# EAGLE board KMO_IO_MV2_8 (EAGLE 9.5.1)
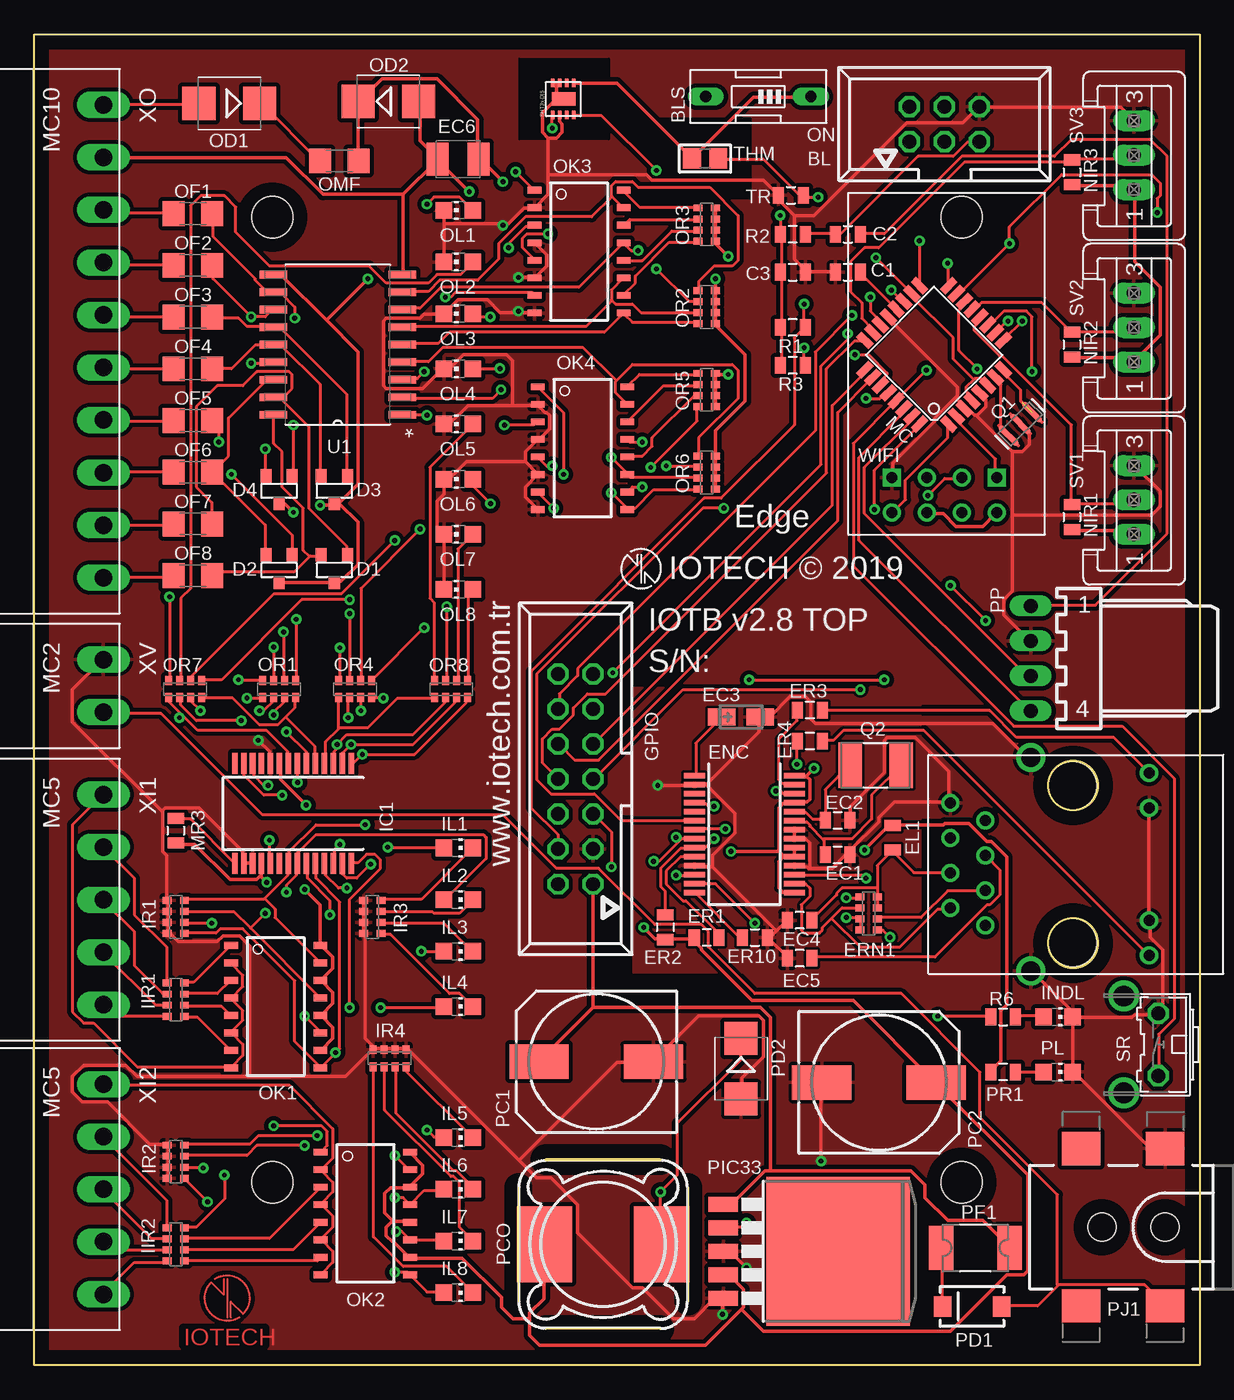
[diagram p2: board, top side]
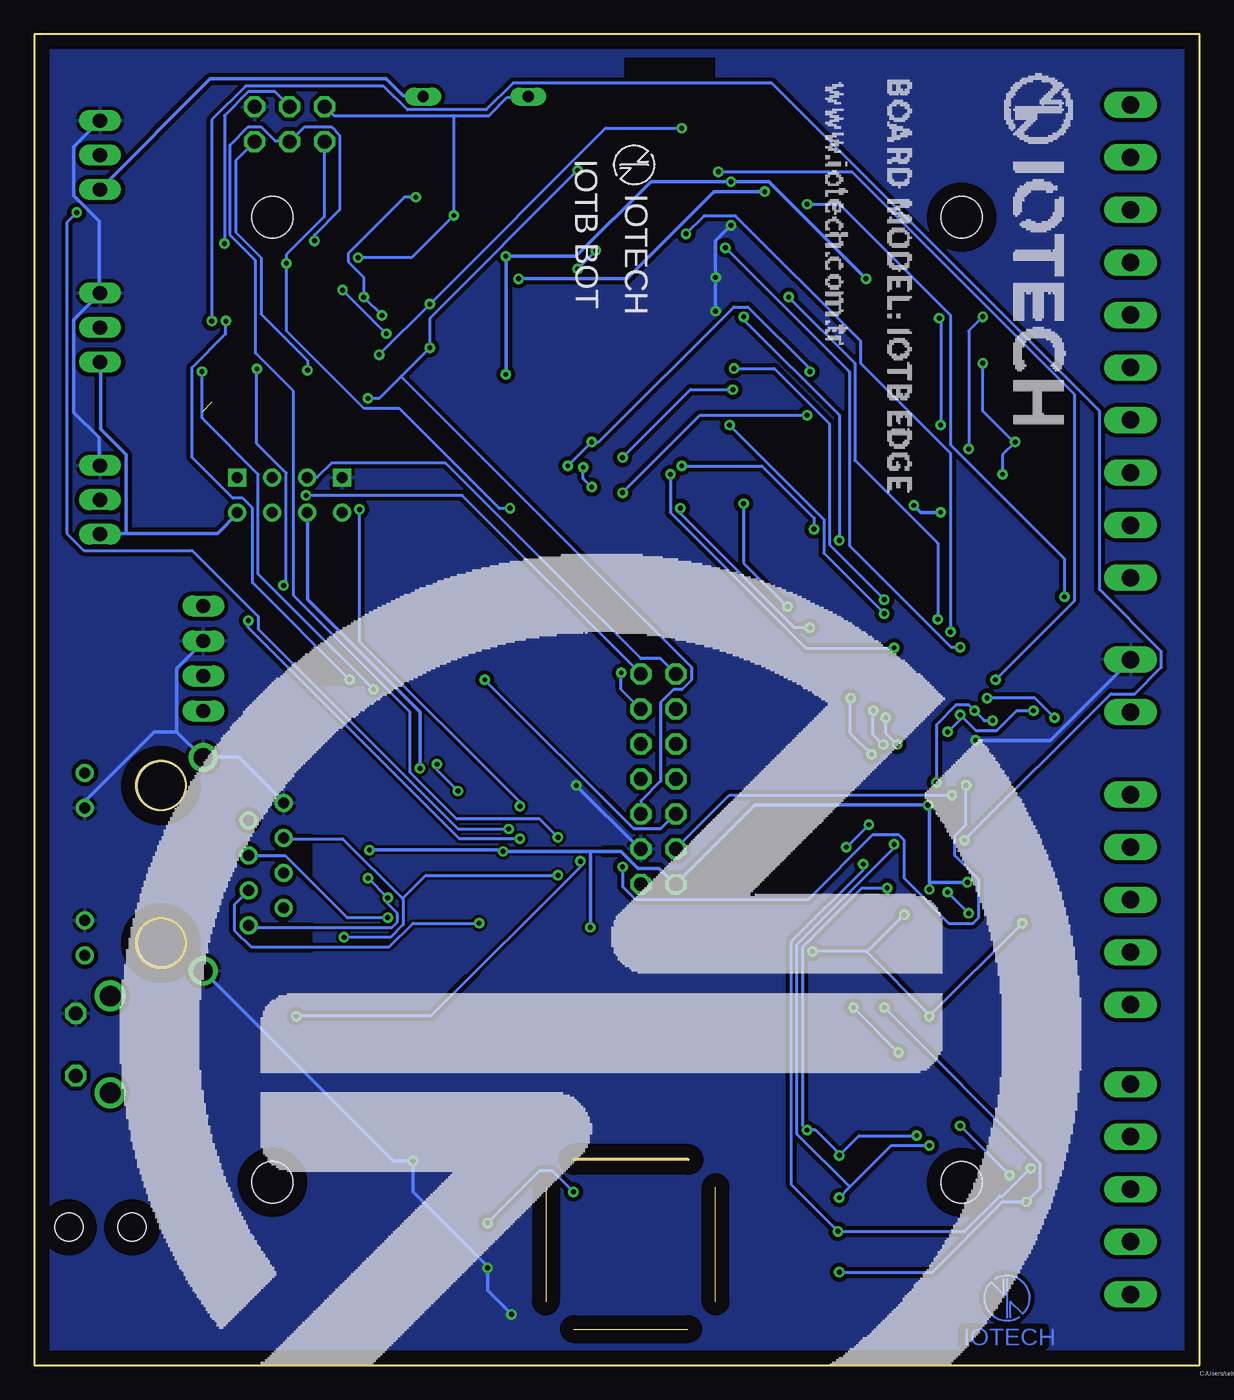
[diagram p3: board, bottom side, seen from below]

Size 84.5 x 96.5 mm. Coordinates in mm from the lower left corner, seen from the top.
Outline: 0,0 0,96.5 84.5,96.5 84.5,0 0,0
Copper layers (1*16): Top 0.035mm / dielectric 1.5mm / Bottom 0.035mm
Design rules "KMO_IO_M": minimum track width 6mil, minimum drill 0.35mm, track to track 0.205mm, track to pad 0.205mm, pad to pad 0.205mm, via to via 0.205mm, smd to smd 6mil, copper to edge 40mil, drill to drill 6mil, minimum pad ring 10mil, minimum via ring 8mil, stop-mask expansion 4mil, vias tented up to drill 0mil, thermal gap 10mil
Net classes: 0 default: width 0.203 mm, drill 0.3 mm, clearance 0.16 mm; 1 vcc: width 0.254 mm, drill 0.3 mm, clearance 0.16 mm; 2 3.3 power line: width 0.254 mm, drill 0.3 mm, clearance 0.16 mm; 3 outsise power line: width 0.254 mm, drill 0.3 mm, clearance 0.16 mm
Holes 3 mm at 17.25,83.25 67.25,83.25 17.25,13.25 67.25,13.25

## Footprints (pad centres in the part's own frame; a part is rotated, then mirrored left to right if it is on the bottom)
057-006-1 = drill 1 octagon: 1 -2.54,-1.27; 2 -2.54,1.27; 3 0,-1.27; 4 0,1.27; 5 2.54,-1.27; 6 2.54,1.27
EDG-01 = drill 0.813 long: 1 0,-3.81; 2 0,3.81
0805 = smd 0.8 x 1.2: 1 -0.9,0; 2 0.9,0
SOT-23-3 = smd 0.802 x 0.972: 1 -0.95,-1; 2 0.95,-1; 3 0,1
CT3216 = smd 2 x 1.2: + -1.4,0; - 1.4,0
SMC_B = smd 1.6 x 2.4: + -1.5,0; - 1.5,0
SSOP28 = smd 0.4 x 1.5: 1 -4.225,-3.625; 2 -3.575,-3.625; 3 -2.925,-3.625; 4 -2.275,-3.625; 5 -1.625,-3.625; 6 -0.975,-3.625; 7 -0.325,-3.625; 8 0.325,-3.625; 9 0.975,-3.625; 10 1.625,-3.625; 11 2.275,-3.625; 12 2.925,-3.625; 13 3.575,-3.625; 14 4.225,-3.625; 15 4.225,3.625; 16 3.575,3.625; 17 2.925,3.625; 18 2.275,3.625; 19 1.625,3.625; 20 0.975,3.625; 21 0.325,3.625; 22 -0.325,3.625; 23 -0.975,3.625; 24 -1.625,3.625; 25 -2.275,3.625; 26 -2.925,3.625; 27 -3.575,3.625; 28 -4.225,3.625
0603-ARV = smd 0.5 x 0.65: 1 -1.2,-0.625; 2 -0.4,-0.625; 3 0.4,-0.625; 4 1.2,-0.625; 5 1.2,0.625; 6 0.4,0.625; 7 -0.4,0.625; 8 -1.2,0.625
057-014-1 = drill 1 octagon: 1 -7.62,-1.27; 2 -7.62,1.27; 3 -5.08,-1.27; 4 -5.08,1.27; 5 -2.54,-1.27; 6 -2.54,1.27; 7 0,-1.27; 8 0,1.27; 9 2.54,-1.27; 10 2.54,1.27; 11 5.08,-1.27; 12 5.08,1.27; 13 7.62,-1.27; 14 7.62,1.27
CHIP-LED0805 = smd 1.2 x 1.2: A 0,-1.05; C 0,1.05
TQFP32-08 = smd 1.27 x 0.559: 1 -4.293,2.8; 2 -4.293,2; 3 -4.293,1.2; 4 -4.293,0.4; 5 -4.293,-0.4; 6 -4.293,-1.2; 7 -4.293,-2; 8 -4.293,-2.8; 17 4.293,-2.8; 18 4.293,-2; 19 4.293,-1.2; 20 4.293,-0.4; 21 4.293,0.4; 22 4.293,1.2; 23 4.293,2; 24 4.293,2.8 | smd 0.559 x 1.27: 9 -2.8,-4.293; 10 -2,-4.293; 11 -1.2,-4.293; 12 -0.4,-4.293; 13 0.4,-4.293; 14 1.2,-4.293; 15 2,-4.293; 16 2.8,-4.293; 25 2.8,4.293; 26 2,4.293; 27 1.2,4.293; 28 0.4,4.293; 29 -0.4,4.293; 30 -1.2,4.293; 31 -2,4.293; 32 -2.8,4.293
SMB = smd 2.4 x 2.4: A 2.2,0; C -2.2,0
1206 = smd 1.6 x 1.8: 1 -1.4,0; 2 1.4,0
MINI-FLAT-16 = smd 1 x 0.5: 1 -3.24,4.445; 2 -3.24,3.175; 3 -3.24,1.905; 4 -3.24,0.635; 5 -3.24,-0.635; 6 -3.24,-1.905; 7 -3.24,-3.175; 8 -3.24,-4.445; 9 3.24,-4.445; 10 3.24,-3.175; 11 3.24,-1.905; 12 3.24,-0.635; 13 3.24,0.635; 14 3.24,1.905; 15 3.24,3.175; 16 3.24,4.445
140CLH-1010 = smd 4.3 x 2.5: + 4.15,0; - -4.15,0
MSS1260 = smd 5.5 x 4: P$1 0,4.25; P$2 0,-4.25
SMA-DIODE = smd 1.27 x 1.47: A -2.15,0; C 2.15,0
1820 = smd 1.78 x 3.2: 1 -2.49,0; 2 2.49,0
TO263-5 = smd 1.067 x 2.159: 1 -3.404,-5.791; 2 -1.702,-5.791; 3 0,-5.791; 4 1.702,-5.791; 5 3.404,-5.791 | smd 10.8 x 10.41: 6 0,2.54
POWER_JACK_SMD_OVERPASTE_TOE = smd 2.8 x 2.4: GND 0,-5.7; P$4 6.1,-5.7; VIN0 0,5.7; VIN1 6.1,5.7 | hole 2.032: 0,0; 4.572,0
7395-04 = drill 1.016 long: 1 3.81,0; 2 1.27,0; 3 -1.27,0; 4 -3.81,0
RESONATOR-SMD-1:1 = smd 0.45 x 1.905: 1 -1.2,0; 2 0,0; 3 1.2,0
5.0X3.2_2 = smd 1.7 x 3.3: 1 -1.85,0; 2 1.85,0
SHT3X = smd 0.55 x 0.25: ADDR -1.175,0.25; ALERT -1.175,-0.25; GND 1.175,0.75; R 1.175,0.25; RESET 1.175,-0.25; SCL -1.175,-0.75; SDA -1.175,0.75; VDD 1.175,-0.75 | smd 1 x 1.7: GND_PAD 0,-0.025
B3F-31XX = drill 1.016 octagon: 1 -2.261,-1.245; 2 2.261,-1.245 | drill 1.499 pad 2.159: 3 -3.505,1.245; 4 3.505,1.245
S03P = drill 1.016 long: 1 2.5,0; 2 0,0; 3 -2.5,0
MICROBUILDER_0805_NOTHERMALS = smd 1.3 x 1.5: 1 -0.95,0; 2 0.95,0
SOIC127P1030X265-18N = smd 1.981 x 0.559: 1 -4.674,5.08; 2 -4.674,3.81; 3 -4.674,2.54; 4 -4.674,1.27; 5 -4.674,0; 6 -4.674,-1.27; 7 -4.674,-2.54; 8 -4.674,-3.81; 9 -4.674,-5.08; 10 4.674,-5.08; 11 4.674,-3.81; 12 4.674,-2.54; 13 4.674,-1.27; 14 4.674,0; 15 4.674,1.27; 16 4.674,2.54; 17 4.674,3.81; 18 4.674,5.08
RJ45 = drill 0.8: G+ 5.84,-6.305; G- 5.84,-3.765; GND -8.57,4.76; NC -6.03,3.5; P4 -8.57,-0.32; P5 -6.03,0.96; RD+ -6.03,-1.58; RD- -8.57,2.22; TD+ -6.03,-4.12; TD- -8.57,-2.86; Y+ 5.84,6.945; Y- 5.84,4.405 | drill 1.4: SHIELD1 -2.73,-7.425; SHIELD2 -2.73,8.065 | hole 3.5: 0.3,-5.38; 0.3,6.02
ESP01 = drill 0.8: CH_PD -1.285,-8.178; GPIO0 1.255,-5.638; GPIO2 -1.285,-5.638; RST 1.255,-8.178; TX -3.825,-8.178; VCC 3.795,-8.178 | drill 0.8 square: GND -3.825,-5.638; RX 3.795,-5.638
MC5 = drill 1.27 long: 1 -7.62,0; 2 -3.81,0; 3 0,0; 4 3.81,0; 5 7.62,0
MC10 = drill 1.27 long: 1 -17.145,0; 2 -13.335,0; 3 -9.525,0; 4 -5.715,0; 5 -1.905,0; 6 1.905,0; 7 5.715,0; 8 9.525,0; 9 13.335,0; 10 17.145,0
MC2 = drill 1.27 long: 1 -1.905,0; 2 1.905,0

## Placement (x,y rotation side)
BL  057-006-1  [057-006-1]  66,90 0 top
BLS  ON  [EDG-01]  52.5,92 90 top
C1  100nF  [0805]  59,79.26 0 top
C2  100nF  [0805]  59,82.01 0 top
C3  100nF  [0805]  55,79.26 0 top
D1  BAV70  [SOT-23-3]  21.75,57.75 180 top
D2  BAV70  [SOT-23-3]  17.75,57.75 180 top
D3  BAV70  [SOT-23-3]  21.75,63.5 180 top
D4  BAV70  [SOT-23-3]  17.75,63.5 180 top
EC1  18p  [0805]  58.25,37 0 top
EC2  18p  [0805]  58.25,39.5 0 top
EC3  10u  [CT3216]  51.25,47 0 top
EC4  10n  [0805]  55.5,32.25 180 top
EC5  10n  [0805]  55.5,29.5 180 top
EC6  10u 25V B  [SMC_B]  30.73,87.45 180 top
EL1  10µH  [0805]  62.25,38.25 270 top
ENC  ENC28J60-SSOP  [SSOP28]  51.5,38.5 270 top
ER1  10k  [0805]  48.75,31 180 top
ER2  10k  [0805]  45.75,31.75 270 top
ER3  1k  [0805]  56.25,47.5 180 top
ER4  1k  [0805]  56.25,45.25 180 top
ER10  2.7K  [0805]  52.25,31 0 top
ERN1  49.9R  [0603-ARV]  60.5,32.75 270 top
GPIO  057-014-1  [057-014-1]  39.25,42.5 90 top
IC1  MCP23017SS  [SSOP28]  18.75,40 180 top
IIR1  6.8K  [0603-ARV]  10.25,26.5 270 top
IIR2  6.8K  [0603-ARV]  10.25,8.75 270 top
IL1  BLU  [CHIP-LED0805]  30.75,37.5 270 top
IL2  BLU  [CHIP-LED0805]  30.75,33.75 270 top
IL3  BLU  [CHIP-LED0805]  30.75,30 270 top
IL4  BLU  [CHIP-LED0805]  30.75,26 270 top
IL5  BLU  [CHIP-LED0805]  30.75,16.5 270 top
IL6  BLU  [CHIP-LED0805]  30.75,12.75 270 top
IL7  BLU  [CHIP-LED0805]  30.75,9 270 top
IL8  BLU  [CHIP-LED0805]  30.75,5.25 270 top
INDL  BLU  [CHIP-LED0805]  74.25,25.25 270 top
IR1  10K  [0603-ARV]  10.25,32.5 90 top
IR2  10K  [0603-ARV]  10.25,14.75 90 top
IR3  1K  [0603-ARV]  24.5,32.5 270 top
IR4  1K  [0603-ARV]  25.75,22.25 180 top
MC  ATMEGA328  [TQFP32-08]  65.25,73.26 135 top
MR3  10K  [0805]  10.25,38.75 270 top
NIR1  4700  [0805]  75.25,61.5 270 top
NIR2  4700  [0805]  75.25,74 270 top
NIR3  4700  [0805]  75.25,86.5 270 top
OD1  SS54  [SMB]  14.13,91.5 180 top
OD2  28V  [SMB]  25.66,91.64 0 top
OF1  200mA  [1206]  11.5,83.5 0 top
OF2  200mA  [1206]  11.5,79.75 0 top
OF3  200mA  [1206]  11.5,76 0 top
OF4  200mA  [1206]  11.5,72.25 0 top
OF5  200mA  [1206]  11.5,68.5 0 top
OF6  200mA  [1206]  11.5,64.75 0 top
OF7  200mA  [1206]  11.5,61 0 top
OF8  200mA  [1206]  11.5,57.25 0 top
OK1  TLP283-4  [MINI-FLAT-16]  17.5,26 0 top
OK2  TLP283-4  [MINI-FLAT-16]  24,11 0 top
OK3  TLP283-4  [MINI-FLAT-16]  39.5,80.75 0 top
OK4  TLP283-4  [MINI-FLAT-16]  39.75,66.5 0 top
OL1  BLU  [CHIP-LED0805]  30.75,83.75 90 top
OL2  BLU  [CHIP-LED0805]  30.75,80 90 top
OL3  BLU  [CHIP-LED0805]  30.75,76.25 90 top
OL4  BLU  [CHIP-LED0805]  30.75,72.25 90 top
OL5  BLU  [CHIP-LED0805]  30.75,68.25 90 top
OL6  BLU  [CHIP-LED0805]  30.75,64.25 90 top
OL7  BLU  [CHIP-LED0805]  30.75,60.25 90 top
OL8  BLU  [CHIP-LED0805]  30.75,56.25 90 top
OMF  2A  [1206]  22.11,87.33 180 top
OR1  1K  [0603-ARV]  17.75,49.02 180 top
OR2  10K  [0603-ARV]  48.75,76.72 270 top
OR3  10K  [0603-ARV]  48.75,82.72 270 top
OR4  1K  [0603-ARV]  23.25,49.02 180 top
OR5  10K  [0603-ARV]  48.75,70.72 270 top
OR6  10K  [0603-ARV]  48.75,64.72 270 top
OR7  1K  [0603-ARV]  10.92,49.02 180 top
OR8  1K  [0603-ARV]  30.23,49.02 180 top
PC1  220uf 50v  [140CLH-1010]  40.75,22 180 top
PC2  220uf 50v  [140CLH-1010]  61.25,20.5 0 top
PCO  220 uh  [MSS1260]  41.25,8.75 90 top
PD1  M7  [SMA-DIODE]  68,4.25 180 top
PD2  SS54  [SMB]  51.25,21.5 270 top
PF1  1A  [1820]  68.25,8.5 0 top
PIC33  LM2596S-3.3  [TO263-5]  55.75,8.25 270 top
PJ1  POWER_JACKTOE  [POWER_JACK_SMD_OVERPASTE_TOE]  82,10 180 top
PL  GRN  [CHIP-LED0805]  74.25,21.25 270 top
PP  22-05-7048-04  [7395-04]  72.25,51.25 90 top
PR1  1k  [0805]  70.25,21.25 180 top
Q1  8MHz  [RESONATOR-SMD-1:1]  71.5,68.26 45 top
Q2  25MHz  [5.0X3.2_2]  61,43.5 0 top
R1  1.5K  [0805]  55,75.25 180 top
R2  10K  [0805]  55,82.01 180 top
R3  1.5K  [0805]  55,72.5 180 top
R6  1k  [0805]  70.25,25.25 0 top
SHT  SHT3X  [SHT3X]  38.35,91.82 90 top
SR  gnd  [B3F-31XX]  80.25,23.25 90 top
SV1  3.3V  [S03P]  79.75,62.75 270 top
SV2  3.3V  [S03P]  79.75,75.25 270 top
SV3  3.3V  [S03P]  79.75,87.75 270 top
THM  THERM  [MICROBUILDER_0805_NOTHERMALS]  48.64,87.5 0 top
TR  10K  [0805]  54.86,84.84 0 top
U1  ULN2803ADW  [SOIC127P1030X265-18N]  22,74 180 top
U$1  [IOTECH_COPPER_W_TEXT]  13.98,4.86 0 top
U$2  HR911105A  [RJ45]  75,36 0 top
U$4  [IOTECH_COPPER_W_TEXT]  13.97,4.86 0 bottom
WIFI  ESP01  [ESP01]  66,70 0 top
XI1  MC5  [MC5]  5,33.75 270 top
XI2  MC5  [MC5]  5,12.75 270 top
XO  MC10  [MC10]  5,74.25 270 top
XV  MC2  [MC2]  5,49.25 270 top

## Tracks (layer width: path | path; a pad name or v marks a point on that pad's centre or on a via)
+3V3  (via drill 0.35)
  Top 0.254: SHT.VDD 39.19,92.97 42.25,92.97 47.66,87.56 THM.1 47.76,87.56 52.15,91.95 56.23,91.95 BLS.1 | NIR3.2 75.31,85.52 79.5,85.52 79.7,85.31 SV3.1 79.8,85.21 79.8,80.01 81.64,78.17 81.64,74.7 79.8,72.86 SV2.1 79.7,72.76 79.39,73.07 75.31,73.07 NIR2.2 | NIR1.2 75.31,60.52 79.5,60.52 79.7,60.31 SV1.1 | WIFI.CH_PD 64.8,61.74 65.92,61.74 66.84,60.82 68.78,60.82 69.7,61.74 WIFI.VCC | OK2.16 27.25,15.41 28.17,14.49 28.17,13.88 27.25,12.96 OK2.14 27.14,12.86 25.82,12.86 25.41,12.45 25.41,11.02 25.92,10.51 25.92,10.41 | 25.92,10.41 25.51,10 25.51,9.39 25.92,8.98 26.02,8.98 27.14,7.86 OK2.10 27.35,7.76 31.02,7.76 33.88,4.9 33.88,4.18 34.7,3.37 35.92,3.37 | 25.92,10.41 27.14,10.41 OK2.12 | 51.28,4.03 48.68,1.43 36.64,1.43 35.92,2.14 35.92,3.37 | 51.28,4.03 51.43,4.18 51.43,5.51 50.41,6.53 50.01,6.53 PIC33.4 | 35.92,3.37 35.92,3.78 36.94,4.8 36.94,8.67 PCO.P$1 | PR1.2 69.39,21.33 70.11,22.04 70.11,25.72 70.52,26.12 70.52,36.84 69.39,37.96 69.09,37.96 67.76,39.29 66.03,39.29 65.92,39.19 62.25,39.19 EL1.1 62.15,39.09 61.94,39.09 v60.21,37.35 | 56.02,42.66 56.23,42.45 56.23,41.02 56.02,40.82 55.21,40.82 ENC.25 55.11,40.72 54.29,40.72 53.98,40.41 53.98,37.25 | 56.02,42.66 55.21,42.66 ENC.28 | 54.29,36.84 53.98,36.53 53.98,34.59 54.29,34.29 55.11,34.29 ENC.15 | 54.29,36.84 55.11,36.84 ENC.19 55.11,36.94 55.11,37.45 ENC.20 | 53.98,37.25 54.29,36.94 54.29,36.84 | 16.38,35.46 16.43,35.51 16.43,36.33 IC1.18 | 16.38,35.46 16.12,35.21 14.19,35.21 11.63,37.76 10.31,37.76 MR3.2 | OK1.10 20.82,22.86 21.64,23.68 21.64,24.49 20.82,25.31 OK1.12 20.82,25.41 21.64,26.23 21.64,27.04 20.82,27.86 OK1.14 20.82,27.96 21.64,28.78 21.64,29.59 20.82,30.41 OK1.16 20.72,30.51 20.72,33.37 v19.59,34.49
  Top 0.254: v19.7,40.62 17.86,42.45 17.86,43.58 IC1.9 | v16.84,35 16.38,35.46 | v50.52,37.25 53.98,37.25 | v44.19,31.74 45,30.92 45.72,30.92 ER2.2 45.82,30.92 47.76,30.92 ER1.2 47.76,30.82 48.37,30.21 48.37,30.11 52.05,26.43 59.39,26.43 65.31,20.51 PC2.+ 65.41,20.41 72.05,13.78 72.05,6.84 71.74,6.53 70.52,6.53 66.44,2.45 52.86,2.45 51.28,4.03 | v56.54,43.27 56.02,42.76 56.02,42.66
  Bottom 0.254: 77.86,60.31 71.23,60.31 69.8,61.74 WIFI.VCC | 77.86,60.31 79.7,60.31 SV1.1 | 77.86,60.31 77.86,66.03 79.7,67.86 79.7,72.66 SV2.1 | BLS.1 56.33,92.05 57.76,92.05 58.98,93.27 71.74,93.27 79.7,85.31 SV3.1 | 19.59,35 19.59,40.62 v19.7,40.62 32.25,40.62 37.96,34.9 GPIO.2 38.06,34.9 39.19,36.02 40.72,36.02 41.94,37.25 44.19,37.25 | 19.59,35 v19.59,34.49 | 19.59,35 v16.84,35 | 44.19,37.25 v50.52,37.25 50.52,37.35 v60.21,37.35 | 44.19,37.25 v44.19,31.74 | v56.54,43.27 56.54,47.35 64.7,55.52 64.7,61.74 WIFI.CH_PD
A0
  Top 0.203: SV3.2 79.7,87.66 79.5,87.46 75.31,87.46 NIR3.1 75.21,87.36 75.11,87.25 67.45,87.25 61.23,81.03 60.21,81.03 59.19,80.01 59.19,77.86 60.01,77.05 60.01,75.92 60.72,75.21 60.72,74.91 MC.23
A1
  Top 0.203: MC.24 60.21,74.29 59.49,74.29 57.45,72.25 57.45,64.7 41.43,48.68 40.11,48.68 39.09,47.66 39.09,47.15 38.06,46.13 37.55,46.13 36.84,45.41 36.84,43.68 37.96,42.55 GPIO.8
A2
  Top 0.203: MC.25 60.21,72.15 60.21,71.94 57.86,69.6 57.86,62.35 40.62,45.11 GPIO.9
A3
  Top 0.203: MC.26 60.72,71.54 58.27,69.09 58.27,61.23 40.92,43.88 39.19,43.88 38.06,45 GPIO.10
A4  (via drill 0.35)
  Top 0.203: v17.96,41.33 16.63,41.33 15.21,42.76 15.21,43.58 IC1.13 | v37.55,89.7 37.55,90.62 SHT.SDA | v55.82,76.95 55.82,75.31 R1.1 55.82,75.21 55.11,74.5 55.11,68.17 49.8,62.86 48.58,62.86 36.02,50.31 36.02,40.41 37.96,38.47 37.96,37.45 GPIO.4 | v59.49,73.27 60.52,73.27 61.84,71.94 61.84,71.84 61.43,71.44 61.43,71.13 MC.27
  Bottom 0.203: v17.96,41.33 34.09,41.33 37.96,37.45 GPIO.4 | v37.55,89.7 43.06,89.7 v55.82,76.95 v59.49,73.27
A5  (via drill 0.35)
  Top 0.203: v16.94,42.05 16.63,42.05 15.92,42.76 15.92,43.58 IC1.12 | v41.84,36.13 41.84,38.68 40.62,39.9 GPIO.5 | v45.11,86.64 41.13,90.62 39.19,90.62 SHT.SCL | v55.82,73.78 55.82,72.56 R3.1 | v60.31,70.11 61.33,70.11 61.64,70.42 61.84,70.42 MC.28
  Bottom 0.203: v16.94,42.05 16.94,39.19 17.76,38.37 17.76,36.94 16.02,35.21 16.02,32.45 16.43,32.04 18.16,32.04 21.43,35.31 21.43,38.06 21.84,38.47 23.68,38.47 28.37,33.78 40.92,33.78 41.84,34.7 v41.84,36.13 | v45.11,86.64 55.82,75.92 v55.82,73.78 57.91,71.69 | v60.31,70.11 59.49,70.11 57.91,71.69 | 57.91,71.69 36.84,50.62 36.84,49.7 37.55,48.98 38.17,48.98 39.09,48.07 39.09,42.35 40.51,40.92 40.51,40 GPIO.5
A6  (via drill 0.35)
  Top 0.203: v62.15,77.97 62.97,77.15 MC.19 | v58.98,74.8 58.98,74.39 57.05,72.46 57.05,65.31 v41.94,50.21
  Bottom 0.203: v58.98,74.8 v62.15,77.97 | v41.94,50.21 41.94,48.98 40.62,47.66 GPIO.11
A7  (via drill 0.35)
  Top 0.203: THM.2 49.6,87.46 52.86,87.46 55.41,84.91 55.72,84.91 TR.2 55.82,84.8 55.92,84.7 v56.84,84.7 | v60.62,77.46 60.62,76.44 61.33,75.72 61.33,75.52 MC.22 | v59.29,76.13 56.64,73.48 56.64,67.76 39.39,50.52 39.39,50.01 38.06,48.68 38.06,47.66 GPIO.12
  Bottom 0.203: v56.84,84.7 57.66,84.7 61.74,80.62 61.74,80.01 60.62,78.89 v60.62,77.46 v59.29,76.13
AREF
  Top 0.203: C1.2 59.9,79.19 62.45,76.64 MC.20
BLV  (via drill 0.35)
  Top 0.203: 68.12,71.49 68.17,71.54 68.68,71.54 69.09,71.13 MC.6 | 68.12,71.49 67.56,70.92 67.56,70.62 67.97,70.21 67.97,70.01 MC.4 | 68.12,71.49 66.64,72.97 66.64,74.5 63.68,77.46 63.68,77.66 MC.18 63.58,77.76 v61.03,80.31 | R3.2 54.19,72.56 54.19,75.21 R1.2 54.19,75.31 54.19,79.19 C3.1 54.19,79.29 54.19,81.95 R2.2 54.09,82.05 v54.09,83.38
  Bottom 0.203: 54.09,90.62 62.76,90.62 63.37,91.23 BL.2 | 54.09,90.62 51.53,90.62 50.21,91.95 48.78,91.95 BLS.2 | 54.09,90.62 v54.09,83.38 57.15,80.31 v61.03,80.31
COM1
  Top 0.203: OK1.2 14.29,29.08 15.1,28.27 15.1,27.45 14.29,26.64 OK1.4 14.29,26.53 15.1,25.72 15.1,25 14.29,24.19 OK1.6 14.29,24.08 15.1,23.27 15.1,22.45 14.29,21.64 OK1.8 14.19,21.64 7.45,21.64 4.29,24.8 3.57,24.8 2.75,25.61 2.75,39.19 4.9,41.33 XI1.1
COM2
  Top 0.203: OK2.8 20.82,6.63 21.64,7.45 21.64,8.27 20.82,9.08 OK2.6 20.82,9.18 21.64,10 21.64,10.82 20.82,11.63 OK2.4 20.82,11.74 21.64,12.55 21.64,13.27 20.82,14.08 OK2.2 20.82,14.19 21.64,15 21.64,17.14 18.47,20.31 5,20.31 XI2.1
D2  (via drill 0.35)
  Top 0.203: v60.92,62.05 60.92,64.9 64.19,68.17 MC.32 | v49.29,40.51 48.88,40.51 48.68,40.72 47.96,40.72 ENC.4
  Bottom 0.203: v60.92,62.05 60.92,52.45 49.29,40.82 v49.29,40.51
D3
  Top 0.203: MC.1 66.23,68.17 66.23,67.25 63.17,64.19 63.17,62.76 62.25,61.84 WIFI.TX
D4
  Top 0.203: MC.2 66.94,68.78 66.94,68.48 69.7,65.72 69.7,64.39 WIFI.RX
D5  (via drill 0.35)
  Top 0.203: v71.64,75.72 70.31,74.39 MC.9 | v17.04,38.06 17.04,36.43 IC1.19
  Bottom 0.203: v71.64,75.72 71.64,90.31 69.19,92.76 59.19,92.76 57.45,91.03 51.74,91.03 49.8,92.97 31.02,92.97 7.25,69.19 7.25,56.23 2.75,51.74 2.75,50.62 4.69,48.68 6.43,48.68 v17.04,38.06
D6  (via drill 0.35)
  Top 0.203: v70.62,75.72 70.52,75.72 69.7,74.91 MC.10 | v51.84,49.7 v61.64,49.7
  Bottom 0.203: v70.62,75.72 70.62,74.8 73.07,72.35 73.07,65.82 70.11,62.86 69.39,62.86 68.68,62.15 68.68,56.74 v61.64,49.7 | v51.84,49.7 41.02,38.88 39.09,38.88 38.06,39.9 GPIO.6
D7  (via drill 0.35)
  Top 0.203: v72.35,72.05 72.35,76.03 71.94,76.44 70.31,76.44 69.39,75.52 69.19,75.52 MC.11 | v59.9,48.98 47.05,48.98 40.62,42.55 GPIO.7
  Bottom 0.203: v72.35,72.05 72.35,68.68 68.27,64.6 68.27,57.35 v59.9,48.98
D8
  Top 0.203: SV1.2 79.7,62.66 79.5,62.45 75.31,62.45 NIR1.1 75.21,62.45 75.21,68.17 70.21,73.17 70.01,73.17 68.17,75.01 68.17,75.31 68.48,75.62 68.48,75.92 MC.12
D9
  Top 0.203: SV2.2 79.7,75.21 79.39,74.91 75.31,74.91 NIR2.1 75.21,74.91 73.07,77.05 68.68,77.05 68.27,76.64 68.07,76.64 MC.13
D10  (via drill 0.35)
  Top 0.203: ER2.1 45.72,32.66 45.72,34.39 45.41,34.7 45.41,36.02 46.84,37.45 47.86,37.45 ENC.9 47.96,37.55 48.68,37.55 v49.29,38.17 | v68.37,72.25 67.05,73.58 67.05,76.54 67.35,76.84 67.35,77.05 MC.14 | v68.99,53.98 v66.44,56.54
  Bottom 0.203: v68.37,72.25 68.37,66.84 66.23,64.7 66.23,56.74 v66.44,56.54 | v68.99,53.98 68.99,53.47 53.68,38.17 v49.29,38.17
D11  (via drill 0.35)
  Top 0.203: MC.15 66.94,77.76 67.15,77.76 v70.72,81.33 70.72,82.56 74.5,86.33 81.03,86.33 81.64,85.72 81.64,84.8 81.44,84.6 v81.44,83.58 | v50.11,38.88 47.96,38.88 ENC.7
  Bottom 0.203: v70.72,81.33 70.72,90.62 68.99,92.36 67.05,92.36 66.03,91.33 BL.4 | v50.11,38.88 53.78,38.88 68.27,53.37 68.27,54.29 73.07,59.09 80.93,59.09 82.15,60.31 82.15,82.86 v81.44,83.58
D12  (via drill 0.35)
  Top 0.203: v66.23,79.91 66.23,78.37 MC.16 | v50.01,62.15 48.47,62.15 36.43,50.11 36.43,42.45 37.45,41.43 40.62,41.43 42.55,39.49 47.86,39.49 ENC.6
  Bottom 0.203: BL.1 63.48,88.68 63.48,83.27 66.23,80.52 v66.23,79.91 66.23,75.01 60.62,69.39 58.07,69.39 50.82,62.15 v50.01,62.15
D13  (via drill 0.35)
  Top 0.203: v64.19,81.54 64.19,78.37 MC.17 | v65.52,25.31 69.29,25.31 R6.1 | v44.9,36.53 45.31,36.53 46.79,38.01 | 46.79,38.01 46.94,38.17 47.86,38.17 ENC.8 | 46.79,38.01 v46.53,38.27
  Bottom 0.203: v64.19,81.54 64.19,81.95 62.35,83.78 62.35,89.19 62.97,89.8 64.9,89.8 65.92,88.78 BL.3 66.03,88.78 67.05,88.78 68.07,89.8 68.99,89.8 70.31,88.48 70.31,81.95 68.48,80.11 68.48,73.37 65.72,70.62 65.72,55.82 57.25,47.35 57.25,42.96 53.88,39.59 47.86,39.59 v46.53,38.27 | v65.52,25.31 55.72,25.31 44.9,36.13 v44.9,36.53
DTR
  Top 0.203: C2.2 59.9,82.05 61.64,82.05 67.25,87.66 73.99,87.66 75.21,88.89 80.93,88.89 82.15,87.66 82.15,60.31 76.95,55.11 72.25,55.11 PP.1
EP4
  Top 0.203: ERN1.7 61.13,33.17 61.13,33.88 ERN1.8 61.13,33.98 61.13,34.59 | 61.13,34.59 61.13,36.23 62.15,37.25 EL1.2 62.25,37.25 63.78,35.72 66.33,35.72 U$2.P4 | 61.13,34.59 58.58,34.59 58.17,34.19 58.17,34.09 56.43,32.35 EC4.1
EP5  (via drill 0.35)
  Top 0.203: ERN1.4 59.9,31.64 59.9,32.35 ERN1.3 59.8,32.45 v58.88,32.45 | EC5.1 56.43,29.59 65.31,29.59 69.09,33.37 69.29,33.37 70.01,34.09 70.01,35.92 68.99,36.94 U$2.P5
  Bottom 0.203: v58.88,32.45 61.84,32.45 66.33,36.94 68.88,36.94 U$2.P5
GND  (via drill 0.35)
  Top 0.254: 9.29,40.21 9.29,37.25 9.59,36.94 9.59,33.78 IR1.5 9.7,33.68 9.7,32.96 IR1.6 9.7,32.86 9.7,32.15 IR1.7 9.7,32.04 9.7,31.33 IR1.8 9.8,31.33 10.41,30.72 13.27,30.72 13.68,31.12 14.9,31.12 15.61,30.41 15.61,20.92 | 9.29,40.21 9.49,40.41 11.94,40.41 15.1,37.25 15.1,36.43 IC1.16 15.21,36.43 15.82,36.43 IC1.17 | v16.23,45.31 17.04,44.49 17.04,43.68 IC1.10 | 9.29,40.21 9.18,40.21 2.75,46.64 2.75,48.98 4.9,51.13 XV.1 | PD2.A 51.33,19.39 51.33,20.82 52.86,22.35 52.86,25 52.56,25.31 48.17,25.31 44.9,22.04 PC1.- 44.8,21.94 42.25,21.94 35.16,14.85 | IR3.1 23.88,33.68 23.88,32.96 IR3.2 23.88,32.86 23.88,32.15 IR3.3 23.88,32.04 23.88,31.33 IR3.4 23.98,31.23 23.98,23.68 24.59,23.06 IR4.4 | IR2.8 9.7,13.57 9.7,14.29 IR2.7 9.7,14.39 9.7,15.1 IR2.6 9.7,15.21 9.7,15.92 IR2.5 9.59,16.02 8.37,16.02 5.31,19.08 3.47,19.08 2.75,19.8 2.75,20.92 3.57,21.74 6.63,21.74 7.45,20.92 15.61,20.92 | IR4.4 24.59,22.96 25.31,22.96 IR4.3 25.41,22.96 26.12,22.96 IR4.2 26.23,22.96 26.94,22.96 IR4.1 27.04,22.96 35.16,14.85 | 15.61,20.92 22.55,20.92 24.49,22.86 IR4.4 | 35.16,14.85 36.43,13.57 37.45,13.57 39.39,11.63 39.39,9.59 43.37,5.61 44.09,5.61 46.33,3.37 47.86,3.37 49.29,4.8 49.9,4.8 PIC33.5 49.9,4.69 v49.9,3.67 | v51.64,7.04 50.52,8.16 50.01,8.16 PIC33.3 | v57.05,14.8 57.05,20.41 PC2.- | OK3.4 36.33,81.33 37.15,80.52 37.15,79.7 36.33,78.89 OK3.6 36.23,78.89 v35.1,78.89 | 35.1,76.33 33.78,76.33 32.86,77.25 30.72,77.25 29.8,76.33 OL3.C 29.59,76.23 28.27,76.23 27.96,75.92 25.51,75.92 25.31,75.72 25.31,71.03 25.51,70.82 28.17,70.82 29.59,72.25 OL4.C 29.8,72.25 30.11,72.25 31.12,73.27 34.23,73.27 34.66,72.84 34.66,69.6
  Top 0.254: 35.1,76.33 36.23,76.33 OK3.8 | v35.1,76.44 35.1,76.33 | OL8.C 29.7,56.33 29.7,60.21 OL7.C 29.59,60.31 29.19,60.72 29.19,62.66 29.7,63.17 29.7,64.19 OL6.C 29.8,64.29 30.11,64.29 31.33,65.52 35.62,65.52 | OK4.8 36.43,62.15 35.62,62.97 35.62,63.68 36.43,64.5 OK4.6 36.43,64.7 35.62,65.52 | 35.62,65.52 35.62,66.23 36.43,67.05 OK4.4 36.64,67.15 37.35,67.86 37.35,68.88 37.15,69.09 37.04,69.09 36.53,69.6 OK4.2 36.43,69.6 34.66,69.6 | 34.66,69.6 31.43,69.6 30.11,68.27 29.8,68.27 OL5.C | 29.7,82.76 29.7,83.68 OL1.C | 29.7,82.76 OL2.C | 37.86,92.97 38.06,92.97 SHT.R | 37.86,92.97 37.66,92.97 SHT.GND | 37.25,88.99 37.86,88.99 38.27,89.4 38.27,90.01 38.06,90.21 38.06,90.62 SHT.ADDR | 37.25,88.99 36.84,89.4 36.84,90.83 37.76,91.74 38.37,91.74 SHT.GND_PAD 37.86,91.84 37.86,92.97 | 37.25,88.99 37.25,86.33 | 37.25,86.33 37.25,84.91 36.33,83.99 OK3.2 36.23,83.89 35.51,83.89 34.39,82.76 33.98,82.76 | 33.98,82.76 29.7,82.76 | C1.1 58.07,79.29 55.92,79.29 C3.2 55.92,79.39 55.11,80.21 55.11,83.38 | 55.11,83.38 53.98,84.5 53.98,84.8 TR.1 53.88,84.91 52.86,85.93 44.8,85.93 44.39,86.33 37.25,86.33 | SV3.3 79.7,90.31 78.78,91.23 68.58,91.23 BL.6 68.48,91.23 67.35,90.11 63.27,90.11 56.54,83.38 55.11,83.38 | v33.98,82.66 33.98,82.76 | U$2.Y- 80.82,40.31 80.82,32.35 U$2.G- 80.93,32.15 80.93,31.02 81.84,30.11 81.84,25.82 81.54,25.51 SR.2 81.44,25.41 79.8,25.41 79.6,25.21 75.42,25.21 INDL.C | INDL.C 75.31,25.21 75.31,21.33 PL.C 75.42,21.23 80.93,15.72 81.95,15.72 PJ1.GND | INDL.C 75.21,25.31 75.21,25.72 72.35,28.57 U$2.SHIELD1 | 53.83,31.48 EC4.2 | 53.83,31.48 53.37,31.02 53.17,31.02 ER10.2 53.27,30.92 54.6,29.59 EC5.2
  Top 0.254: 49.19,36.13 47.96,36.13 ENC.11 | 53.83,31.48 49.19,36.13 | 48.78,42.15 47.96,42.15 ENC.2 47.76,42.05 v45.21,42.05 | 48.78,42.15 52.56,45.92 52.56,46.94 EC3.- 52.76,47.05 53.37,47.05 54.8,48.47 55.92,48.47 56.33,48.07 56.33,46.84 56.64,46.53 69.5,46.53 71.94,44.09 72.25,44.09 U$2.SHIELD2 | 49.19,36.13 49.19,36.94 50.82,38.58 50.82,40 48.78,42.05 48.78,42.15 | 68.37,68.88 68.17,68.88 67.76,69.29 67.45,69.29 MC.3 67.45,69.5 66.94,70.01 66.94,70.21 | 68.37,68.88 68.99,69.5 68.99,70.01 68.58,70.42 MC.5 | 66.94,70.21 66.94,70.92 61.94,75.92 MC.21 | 70.92,66.23 71.64,66.23 72.15,66.74 72.15,67.45 Q1.2 | 70.92,66.23 68.37,68.78 68.37,68.88 | WIFI.GND 62.25,64.39 62.25,65.41 65.31,68.48 65.31,68.68 66.84,70.21 66.94,70.21 | ENC.22 55.11,38.78 55.11,38.27 ENC.21 55.21,38.17 55.92,38.17 56.23,37.86 56.23,36.02 | 56.23,36.02 56.13,36.02 56.02,36.13 55.21,36.13 ENC.18 | 56.23,36.02 57.86,36.02 58.78,36.94 59.09,36.94 EC1.2 59.19,37.04 59.19,37.35 61.23,39.39 61.23,39.7 62.35,40.82 66.23,40.82 U$2.GND 66.33,40.82 66.33,43.06 63.88,45.51 61.84,45.51 61.64,45.31 61.64,42.96 59.19,40.51 59.19,39.59 EC2.2 | 70.92,61.64 70.92,56.13 70.31,55.52 70.31,54.39 72.15,52.56 PP.2 | 70.92,61.64 70.92,66.23 | 70.92,61.64 81.03,61.64 81.64,62.25 81.64,63.37 79.8,65.21 SV1.3
  Bottom 0.254: v16.23,45.31 10.82,45.31 5,51.13 XV.1 | v49.9,3.67 51.64,5.41 v51.64,7.04 51.64,7.14 57.05,12.55 v57.05,14.8 58.48,14.8 72.25,28.57 U$2.SHIELD1 | v35.1,76.44 v35.1,78.89 35.1,81.54 v33.98,82.66 | SV1.3 79.8,65.31 79.8,67.25 81.64,69.09 81.64,75.82 79.8,77.66 SV2.3 79.8,77.86 79.8,82.97 81.64,84.8 81.64,88.38 79.8,90.21 SV3.3 | v45.21,42.05 40.62,37.45 GPIO.3 | 74.19,45.92 74.19,50.52 72.25,52.45 PP.2 | 74.19,45.92 72.35,44.09 U$2.SHIELD2 72.15,44.09 69.7,44.09 66.44,40.82 U$2.GND | 74.19,45.92 75.82,45.92 80.82,40.92 80.82,40.41 U$2.Y-
  pour Top (isolate 0.305): -3.12,98.3 87,98.3 87,-1.65 -3.94,-1.65 -3.94,97.48
  pour Bottom (isolate 0.305): -5.33,99.44 88.01,99.44 88.01,-3.17 -5.33,-3.17
  cutout Top: 35.18,94.74 41.66,94.74 41.66,88.9 35.18,88.9
  cutout Bottom: 35.18,94.74 41.66,94.74 41.66,88.9 35.18,88.9
  pour Top: 43.43,49.15 64.26,49.15 64.26,28.45 43.43,28.45
  pour Bottom: 43.43,49.15 64.26,49.15 64.26,28.45 43.43,28.45
  cutout Bottom: 45.34,90.42 51.94,90.42 51.94,84.58 45.34,84.58
  cutout Top: 45.34,90.42 51.94,90.42 51.94,84.58 45.34,84.58
GNDO  (via drill 0.35)
  Top 0.254: OR6.5 49.39,63.58 49.39,64.29 OR6.6 49.39,64.39 49.39,65.01 OR6.7 49.39,65.21 49.39,65.82 OR6.8 49.39,66.03 49.39,67.76 51.53,69.9 51.53,73.27 49.39,75.42 OR2.5 49.39,75.62 49.39,76.23 OR2.6 49.39,76.44 49.39,77.05 OR2.7 49.39,77.15 49.39,77.86 OR2.8 49.39,77.97 v49.39,78.78 | 26.74,84.91 26.74,79.09 U1.9 | 26.74,84.91 29.19,87.36 EC6.- | OD2.A 27.96,91.64 27.96,88.78 29.19,87.56 EC6.- | 26.74,84.91 20.92,84.91 18.27,87.56 5,87.56 XO.2 | v31.53,85.11 29.29,87.36 EC6.-
  Bottom 0.254: v49.39,78.78 41.53,78.78 35.21,85.11 v31.53,85.11
GPA0  (via drill 0.35)
  Top 0.203: 16.68,33.83 18.37,35.51 18.37,36.33 IC1.21 18.47,36.43 18.47,37.25 20.41,39.19 v23.98,39.19 | 16.68,33.83 16.63,33.78 10.92,33.78 IR1.4 | 16.68,33.83 17.45,33.06 17.45,32.45 20.72,29.19 OK1.15 | v25.61,37.55 29.7,37.55 IL1.A
  Bottom 0.203: v23.98,39.19 v25.61,37.55
GPA1  (via drill 0.35)
  Top 0.203: 15.66,31.69 20.72,26.64 OK1.13 | 15.66,31.69 14.49,32.86 10.92,32.86 IR1.3 | IL2.A 29.8,33.78 32.76,36.74 32.76,38.27 32.55,38.47 20.41,38.47 19.08,37.15 19.08,36.43 IC1.22 18.98,36.33 18.98,35.51 18.27,34.8 v18.27,34.29 | v16.74,32.76 15.66,31.69
  Bottom 0.203: v18.27,34.29 v16.74,32.76
GPA2  (via drill 0.35)
  Top 0.203: v12.86,32.04 10.92,32.04 IR1.2 | v19.59,25.31 20.72,24.19 OK1.11 | v28.06,30 IL3.A | v21.43,32.66 21.43,33.68 19.8,35.31 19.8,36.33 IC1.23
  Bottom 0.203: v12.86,32.04 v19.59,25.31 19.59,25.41 24.14,29.95 | v28.06,30 24.19,30 24.14,29.95 | 24.14,29.95 v21.43,32.66
GPA3  (via drill 0.35)
  Top 0.203: IR1.1 10.92,31.33 13.16,31.33 13.47,31.64 15.1,31.64 18.88,27.86 18.88,23.47 20.72,21.64 OK1.9 20.82,21.64 v21.84,22.66 22.14,22.96 22.14,33.57 20.41,35.31 20.41,36.33 IC1.24 | v25.1,25.92 29.7,25.92 IL4.A
  Bottom 0.203: v21.84,22.66 v25.1,25.92
GPA4  (via drill 0.35)
  Top 0.203: v20.51,16.63 16.23,16.63 15.61,16.02 10.92,16.02 IR2.4 | v26.12,15.21 27.14,14.19 OK2.15 | v28.47,17.04 28.98,16.53 29.7,16.53 IL5.A | v22.66,34.59 22.04,34.59 21.12,35.51 21.12,36.33 IC1.25
  Bottom 0.203: v20.51,16.63 24.7,16.63 v26.12,15.21 26.12,15.31 27.86,17.04 v28.47,17.04 28.78,17.35 28.78,30.31 24.49,34.59 v22.66,34.59
GPA5  (via drill 0.35)
  Top 0.203: v19.59,15.92 16.12,15.92 15.41,15.21 10.92,15.21 IR2.3 | v26.12,12.14 26.74,12.14 27.14,11.74 OK2.13 28.27,12.65 29.7,12.65 IL6.A | v22.14,37.76 21.74,37.35 21.74,36.43 IC1.26
  Bottom 0.203: v19.59,15.92 22.35,15.92 25.36,12.91 | v26.12,12.14 25.36,12.91 | v22.14,37.76 22.14,37.55 29.19,30.51 29.19,16.74 25.36,12.91
GPA6  (via drill 0.35)
  Top 0.203: v12.25,14.29 10.92,14.29 IR2.2 | v26.23,9.7 26.64,9.7 27.14,9.18 OK2.11 27.25,9.08 29.7,9.08 IL7.A | v24.39,36.33 23.37,35.31 22.66,35.31 22.35,35.62 22.35,36.33 IC1.27
  Bottom 0.203: v12.25,14.29 14.29,12.25 14.49,12.25 17.04,9.7 v26.23,9.7 29.59,13.06 29.59,30.72 24.39,35.92 v24.39,36.33
GPA7  (via drill 0.35)
  Top 0.203: v12.55,11.84 10.92,13.47 IR2.1 | v26.12,6.74 27.04,6.74 27.14,6.63 OK2.9 27.25,6.53 28.47,5.31 29.7,5.31 IL8.A | v22.86,25.92 22.86,33.78 25.1,36.02 25.1,36.64 24.7,37.04 24.08,37.04 23.47,36.43 23.06,36.43 IC1.28
  Bottom 0.203: v26.12,6.74 19.39,6.74 14.29,11.84 v12.55,11.84 11.53,12.86 11.53,14.59 v22.86,25.92
GPB0  (via drill 0.35)
  Top 0.203: v25.31,48.37 24.49,48.37 OR4.8 | IC1.1 23.06,43.58 v23.78,44.29 27.55,44.29 31.33,48.07 31.33,48.37 OR8.8
  Bottom 0.203: v25.31,48.37 25.31,45.82 v23.78,44.29
GPB1  (via drill 0.35)
  Top 0.203: v23.68,47.45 23.68,48.37 OR4.7 | IC1.2 22.35,43.68 22.35,44.39 v22.96,45 27.45,45 30.61,48.17 30.61,48.37 OR8.7
  Bottom 0.203: v23.68,47.45 23.68,45.72 v22.96,45
GPB2  (via drill 0.35)
  Top 0.203: v22.76,46.94 22.76,48.37 OR4.6 | IC1.3 21.74,43.68 21.74,44.49 21.94,44.7 v21.94,45 22.66,45.72 27.45,45.72 29.8,48.07 29.8,48.37 OR8.6
  Bottom 0.203: v22.76,46.94 22.76,45.82 v21.94,45
GPB3
  Top 0.203: 22.04,46.23 22.04,46.13 21.12,45.21 21.12,43.68 IC1.4 | 22.04,46.23 22.04,48.37 OR4.5 | 22.04,46.23 24.19,46.23 26.33,48.37 28.98,48.37 OR8.5
GPB4
  Top 0.203: 18.22,46.99 18.88,47.66 18.88,48.37 OR1.8 | 18.22,46.99 17.66,46.43 16.33,46.43 14.39,48.37 12.14,48.37 OR7.8 | 18.22,46.99 20.31,44.9 20.31,43.68 IC1.5
GPB5  (via drill 0.35)
  Top 0.203: v12.04,47.45 11.33,48.17 11.33,48.37 OR7.7 | v17.35,47.15 17.35,47.35 18.06,48.07 18.06,48.37 OR1.7 | v18.27,45.92 19.7,44.49 19.7,43.68 IC1.6
  Bottom 0.203: v12.04,47.45 13.27,47.45 14.7,46.02 16.23,46.02 v17.35,47.15 17.25,46.94 v18.27,45.92
GPB6  (via drill 0.35)
  Top 0.203: v15,46.74 11.74,46.74 10.61,47.86 10.61,48.37 OR7.6 | v16.33,47.45 16.63,47.45 17.35,48.17 17.35,48.37 OR1.6 | v19.08,42.25 19.08,43.58 IC1.7
  Bottom 0.203: v15,46.74 15.61,46.74 v16.33,47.45 16.74,47.86 17.66,47.86 19.08,46.43 v19.08,42.25
GPB7  (via drill 0.35)
  Top 0.203: 10.71,47.15 11.84,46.02 16.84,46.02 18.37,44.49 18.37,43.68 IC1.8 | 10.71,47.15 9.8,48.07 9.8,48.37 OR7.5 | v15.41,48.37 16.53,48.37 OR1.5 | 10.71,47.15 v10.51,46.94
  Bottom 0.203: v15.41,48.37 11.94,48.37 v10.51,46.94
IO5
  Top 0.203: 42.2,71.38 42.15,71.33 42.15,70.52 42.96,69.7 OK4.15 | 42.2,71.38 43.37,72.56 50.62,72.56 51.02,72.15 51.02,70.11 48.17,67.25 48.17,65.92 OR6.1 | 42.2,71.38 39.8,73.78 29.59,73.78 28.57,72.76 26.74,72.76 U1.4
IO6  (via drill 0.35)
  Top 0.203: v45.82,65.21 48.07,65.21 OR6.2 | v44.09,66.94 43.17,66.94 43.06,67.05 OK4.13 | v28.27,72.05 27.76,71.54 26.74,71.54 U1.3
  Bottom 0.203: v45.82,65.21 v44.09,66.94 43.58,66.94 33.78,76.74 32.76,76.74 28.27,72.25 v28.27,72.05
IO7  (via drill 0.35)
  Top 0.203: OR6.3 48.07,64.39 43.17,64.39 43.06,64.5 OK4.11 42.96,64.7 v41.84,65.82 | v33.84,70.74 33.21,70.11 26.75,70.11 U1.2
  Bottom 0.203: v33.84,70.74 36.92,70.74 v41.84,65.82
IO8  (via drill 0.35)
  Top 0.203: OR6.4 48.07,63.48 44.9,63.48 43.58,62.15 43.06,62.15 OK4.9 42.96,62.15 v41.84,63.27 | v28.47,68.88 26.74,68.88 U1.1
  Bottom 0.203: v28.47,68.88 36.23,68.88 v41.84,63.27
LEDA
  Top 0.203: ER3.1 57.25,47.45 69.29,47.45 71.23,45.51 78.27,45.51 80.82,42.96 U$2.Y+
LEDB
  Top 0.203: ER4.1 57.25,45.31 57.96,45.31 58.68,46.02 64.5,46.02 80.82,29.7 U$2.G+
N$1
  Top 0.203: OD1.A 11.84,91.44 5,91.44 XO.1
N$2
  Top 0.203: PD1.C 65.82,4.29 65.82,8.47 PF1.1
N$3
  Top 0.203: MR3.1 10.31,39.59 11.33,39.59 14.49,36.43 IC1.15
N$4
  Top 0.203: OMF.2 20.61,87.36 16.43,91.54 OD1.C
N$5
  Top 0.203: R6.2 71.23,25.31 73.17,25.31 INDL.A
N$6
  Top 0.203: OF8.1 10,57.15 5,57.15 XO.10
N$7
  Top 0.203: D1.1 22.66,58.78 22.66,59.39 19.9,62.15 19.9,68.07 17.86,70.11 17.35,70.11 U1.17 17.96,70.11 18.68,70.82 18.68,71.84 18.47,72.05 16.12,72.05 15.1,71.03 13.27,71.03 11.74,69.5 11.74,63.68 12.86,62.56 12.86,61.03 OF7.2
N$8  (via drill 0.35)
  Top 0.203: v14.8,49.7 16.53,49.7 OR1.4 | v34.9,86.54 36.23,85.21 OK3.1
  Bottom 0.203: v14.8,49.7 9.08,55.41 9.08,70.42 25.21,86.54 v34.9,86.54
N$9
  Top 0.203: ER3.2 55.31,47.45 55.31,46.74 53.98,45.41 53.98,42.45 54.29,42.15 55.11,42.15 ENC.27
N$10  (1 unrouted)
  Top 0.203: MC.8 70.31,72.15 70.31,71.94 71.54,70.72 71.54,69.9 71.63,69.83
N$11
  Top 0.203: PR1.1 71.23,21.23 73.17,21.23 PL.A
N$12
  Top 0.203: IR3.8 25.21,33.78 28.06,33.78 31.74,37.45 IL1.C
N$13
  Top 0.203: ENC.1 47.96,42.76 47.96,45.11 49.8,46.94 EC3.+
N$14  (via drill 0.35)
  Top 0.203: v55.31,43.58 55.31,45.21 ER4.2 | v53.78,41.64 54.09,41.64 54.29,41.43 55.11,41.43 ENC.26
  Bottom 0.203: v55.31,43.58 55.31,43.17 v53.78,41.64
N$15
  Top 0.203: MC.7 69.7,71.54 70.11,71.13 70.11,68.07 Q1.1
N$16  (via drill 0.35)
  Top 0.203: v51.64,10.31 51.33,10 50.01,10 PIC33.2 | PCO.P$2 45.41,8.78 v45.41,12.55 46.64,13.78 46.64,17.55 51.23,22.14 51.23,23.68 PD2.C
  Bottom 0.203: v51.64,10.31 47.86,14.08 46.94,14.08 v45.41,12.55
N$17
  Top 0.203: ER1.1 49.6,31.02 49.6,31.33 47.25,33.68 47.05,33.68 45.82,34.9 45.82,35.82 46.84,36.84 47.86,36.84 ENC.10
N$18
  Top 0.203: IIR1.1 9.59,27.76 9.59,30.31 7.25,32.66 7.25,35.31 XI1.2
N$19
  Top 0.203: ER10.1 51.33,31.02 51.13,31.02 47.96,34.19 ENC.14
N$20
  Top 0.203: IR3.7 25.21,32.86 28.88,32.86 28.98,32.76 30.82,32.76 31.74,33.68 IL2.C
N$21
  Top 0.203: IR3.6 25.21,32.04 29.7,32.04 31.74,30 IL3.C
N$22
  Top 0.203: ENC.24 55.21,40.11 55.92,40.11 56.43,39.59 57.25,39.59 EC2.1 57.35,39.59 57.35,41.74 59.09,43.47 Q2.1
N$23
  Top 0.203: IR3.5 25.21,31.23 25.82,31.23 30.11,26.94 30.82,26.94 31.74,26.02 IL4.C
N$24
  Top 0.203: 57.2,38.12 56.23,39.09 56.23,39.19 56.02,39.39 55.21,39.39 ENC.23 | 57.2,38.12 57.25,38.06 57.25,37.04 EC1.1 | 57.2,38.12 57.25,38.17 59.29,38.17 60.72,39.59 60.72,41.33 62.86,43.47 Q2.2
N$25
  Top 0.203: IR4.8 27.04,21.53 27.04,21.23 31.74,16.53 IL5.C
N$26
  Top 0.203: IR4.7 26.23,21.53 26.23,18.27 30.41,14.08 30.61,14.08 31.74,12.96 31.74,12.76 IL6.C
N$27
  Top 0.203: IR4.6 25.41,21.53 25.41,18.47 30.21,13.68 30.41,13.68 30.82,13.27 30.82,10 31.74,9.08 IL7.C
N$28
  Top 0.203: IIR1.2 9.59,26.94 9.29,26.94 7.25,28.98 7.25,31.43 5,33.68 XI1.3
N$29
  Top 0.203: IIR1.8 10.92,27.76 11.53,27.76 14.19,30.41 OK1.1
N$30
  Top 0.203: IIR1.7 10.92,26.94 13.27,26.94 14.19,27.86 OK1.3
N$31
  Top 0.203: IIR1.6 10.92,26.02 13.57,26.02 14.19,25.41 OK1.5
N$32
  Top 0.203: IIR1.5 10.92,25.21 11.84,25.21 14.19,22.86 OK1.7
N$33
  Top 0.203: IIR1.3 9.59,26.12 8.78,26.12 5,29.9 XI1.4
N$34
  Top 0.203: IIR1.4 9.59,25.31 5.82,25.31 XI1.5
N$35  (via drill 0.35)
  Top 0.203: v17.35,52.07 17.35,49.7 OR1.3 | v34.39,81.03 34.39,81.33 35.62,82.56 36.23,82.56 OK3.3
  Bottom 0.203: v17.35,52.07 18.03,52.07 25.41,59.45 25.41,72.05 v34.39,81.03
N$36
  Top 0.203: IIR2.1 9.59,10 9.59,11.94 5,16.53 XI2.2
N$37  (via drill 0.35)
  Top 0.203: v13.78,13.78 13.78,12.04 11.74,10 10.92,10 IIR2.8 | v17.35,17.35 20.82,17.35 21.23,16.94 21.23,15.92 20.82,15.51 OK2.1
  Bottom 0.203: v17.35,17.35 v13.78,13.78
N$38
  Top 0.203: IIR2.2 9.59,9.18 8.47,9.18 5,12.65 XI2.3
N$39
  Top 0.203: IIR2.7 10.92,9.18 17.04,9.18 20.72,12.86 OK2.3
N$40
  Top 0.203: IIR2.3 9.59,8.37 5.51,8.37 5,8.88 XI2.4
N$41
  Top 0.203: IIR2.6 10.92,8.37 18.78,8.37 20.72,10.31 OK2.5
N$42
  Top 0.203: IIR2.4 9.59,7.45 7.25,7.45 5,5.21 XI2.5
N$43
  Top 0.203: IIR2.5 10.92,7.55 20.51,7.55 20.72,7.76 OK2.7
N$44
  Top 0.203: IR4.5 24.59,21.53 24.59,9.29 26.74,7.14 29.9,7.14 31.74,5.31 IL8.C
N$45  (via drill 0.35)
  Top 0.203: v18.06,53.17 18.06,49.7 OR1.2 | v37.25,82.05 35.72,82.05 35.41,81.74 35.41,81.03 36.23,80.21 OK3.5
  Bottom 0.203: v18.06,53.17 18.06,66.13 24.59,72.66 24.59,74.29 33.68,83.38 35.92,83.38 v37.25,82.05
N$46  (via drill 0.35)
  Top 0.203: v18.98,54.09 18.98,49.7 OR1.1 | v29.8,77.46 30.21,77.46 30.51,77.76 36.13,77.76 36.23,77.66 OK3.7
  Bottom 0.203: v18.98,54.09 18.98,59.6 25,65.62 25,72.66 v29.8,77.46
N$47
  Top 0.203: 19.95,58.63 18.88,57.56 13.27,57.56 12.96,57.25 OF8.2 | 19.95,58.63 20,58.68 20.72,58.68 D1.2 | 19.95,58.63 19.49,59.09 19.49,62.15 17.96,63.68 17.96,66.23 17.35,66.84 17.35,68.88 U1.18
N$48
  Top 0.203: OR3.1 48.07,83.99 43.88,83.99 42.76,85.11 OK3.16
N$49
  Top 0.203: D2.2 16.74,58.78 16.74,60.92 12.96,64.7 OF6.2 12.96,64.8 14.08,65.92 14.08,68.68 16.84,71.44 17.25,71.44 U1.16
N$50  (via drill 0.35)
  Top 0.203: v14.29,64.6 18.68,60.21 18.68,58.78 D2.1 | v13.37,66.94 13.37,68.07 12.96,68.48 OF5.2 | v15.72,72.66 17.25,72.66 U1.15
  Bottom 0.203: v14.29,64.6 14.29,66.03 v13.37,66.94 13.47,66.94 15.72,69.19 v15.72,72.66
N$51
  Top 0.203: OF7.1 10,60.92 5,60.92 XO.9
N$52
  Top 0.203: OF6.1 10,64.8 5,64.8 XO.8
N$53
  Top 0.203: OR3.2 48.07,83.07 43.17,83.07 42.76,82.66 OK3.14
N$54
  Top 0.203: OF5.1 10,68.48 5,68.48 XO.7
N$55
  Top 0.203: OF4.1 10,72.25 5,72.25 XO.6
N$56
  Top 0.203: OR3.3 48.07,82.25 46.23,82.25 44.09,80.11 42.76,80.11 OK3.12
N$57
  Top 0.203: D3.1 22.66,64.6 22.66,70.42 17.86,75.21 17.35,75.21 U1.13 17.25,75.31 15.41,75.31 14.8,75.92 12.96,75.92 OF3.2
N$58
  Top 0.203: OR3.4 48.07,81.44 46.02,81.44 43.58,78.99 43.58,78.48 42.76,77.66 OK3.10
N$59  (via drill 0.35)
  Top 0.203: v16.74,66.44 16.74,64.6 D4.2 | U1.12 17.25,76.54 16.74,76.03 v15.72,76.03 12.96,78.78 12.96,79.7 OF2.2
  Bottom 0.203: v16.74,66.44 16.74,75.01 v15.72,76.03
N$60  (via drill 0.35)
  Top 0.203: v9.8,55.72 9.8,49.7 OR7.4 | v28.47,84.19 28.98,84.7 30.82,84.7 31.74,83.78 OL1.A
  Bottom 0.203: v9.8,55.72 9.8,58.48 18.06,66.74 18.06,76.13 26.12,84.19 v28.47,84.19
N$61
  Top 0.203: OR7.3 10.61,49.7 10.61,55.62 11.33,56.33 11.33,84.09 12.04,84.8 13.78,84.8 14.59,83.99 14.59,82.15 17.04,79.7 24.29,79.7 25.51,78.48 28.57,78.48 29.19,79.09 30.92,79.09 31.74,79.91 OL2.A
N$62  (via drill 0.35)
  Top 0.203: v26.12,59.8 22.25,55.92 17.35,55.92 11.33,49.9 11.33,49.7 OR7.2 | v33.06,76.03 32.04,76.03 31.84,76.23 OL3.A
  Bottom 0.203: v26.12,59.8 26.12,68.88 33.06,75.82 v33.06,76.03
N$63  (via drill 0.35)
  Top 0.203: v22.86,55.52 19.39,55.52 13.57,49.7 12.14,49.7 OR7.1 | v33.77,72.27 33.74,72.25 OL4.A
  Bottom 0.203: v22.86,55.52 26.84,59.49 26.84,68.27 30.84,72.27 v33.77,72.27
N$64  (via drill 0.35)
  Top 0.203: v18.78,68.17 18.78,64.6 D4.1 | v18.88,75.92 18.88,76.74 17.86,77.76 17.35,77.76 U1.11 17.25,77.86 16.84,77.86 16.02,78.68 16.02,78.78 12.96,81.84 12.96,83.48 OF1.2
  Bottom 0.203: v18.78,68.17 18.78,75.82 v18.88,75.92
N$65
  Top 0.203: D3.2 20.72,64.6 20.72,71.13 17.86,73.99 17.35,73.99 U1.14 17.25,73.99 16.02,73.99 14.29,72.25 12.96,72.25 OF4.2
N$66
  Top 0.203: OF3.1 10,76.03 5.1,76.03 5,76.13 XO.5
N$67
  Top 0.203: OF2.1 10,79.8 5.1,79.8 5,79.91 XO.4
N$68
  Top 0.203: OF1.1 10,83.58 5.1,83.58 5,83.68 XO.3
N$69  (via drill 0.35)
  Top 0.203: v22.14,52.01 22.14,49.7 OR4.4 | v38.37,64.6 38.37,69.09 36.53,70.92 OK4.1
  Bottom 0.203: v22.14,52.01 28.54,52.01 38.37,61.84 v38.37,64.6
N$70  (via drill 0.35)
  Top 0.203: v22.86,54.49 22.86,49.7 OR4.3 | v34.09,68.17 36.23,68.17 36.43,68.37 OK4.3
  Bottom 0.203: v22.86,54.49 27.25,58.88 27.25,61.33 v34.09,68.17
N$71  (via drill 0.35)
  Top 0.203: v27.96,60.62 23.68,56.33 23.68,49.7 OR4.2 | v37.55,65.21 37.15,65.21 36.53,65.82 OK4.5
  Bottom 0.203: v27.96,60.62 27.96,61.43 31.74,65.21 v37.55,65.21
N$72  (via drill 0.35)
  Top 0.203: v28.27,53.47 24.49,49.7 OR4.1 | v37.66,62.15 36.53,63.27 OK4.7
  Bottom 0.203: v28.27,53.47 29.39,53.47 37.66,61.74 v37.66,62.15
N$73
  Top 0.203: OR5.1 48.07,71.84 43.88,71.84 43.06,71.03 OK4.16
N$74
  Top 0.203: OR5.2 48.07,71.03 45.62,71.03 43.06,68.48 OK4.14
N$75
  Top 0.203: OR5.3 48.07,70.31 47.86,70.31 44.8,67.25 44.8,66.64 44.09,65.92 43.06,65.92 OK4.12
N$76  (via drill 0.35)
  Top 0.203: v44.7,65.11 48.07,68.48 48.07,69.5 OR5.4 | v44.09,63.68 43.37,63.68 43.06,63.37 OK4.10
  Bottom 0.203: v44.7,65.11 44.7,64.29 v44.09,63.68
N$77
  Top 0.203: OR8.4 28.98,49.7 28.98,55.31 28.68,55.62 28.68,65.11 31.74,68.17 OL5.A
N$78  (via drill 0.35)
  Top 0.203: v29.9,55.01 29.9,49.7 OR8.3 | v33.08,62.48 31.74,63.82 31.74,64.19 OL6.A
  Bottom 0.203: v33.08,62.48 33.08,58.18 v29.9,55.01
N$79
  Top 0.203: OR8.2 30.72,49.7 30.72,59.19 31.74,60.21 OL7.A
N$80
  Top 0.203: OR8.1 31.43,49.7 31.43,55.92 31.74,56.23 OL8.A
OI1
  Top 0.203: 41.89,84.75 42.66,83.99 OK3.15 | 41.89,84.75 41.84,84.8 41.84,85.52 42.15,85.82 43.37,85.82 43.78,85.42 48.98,85.42 51.02,83.38 51.02,80.11 50.62,79.7 49.29,79.7 48.17,78.58 48.17,77.97 OR2.1 | 41.89,84.75 40.41,83.27 35.62,83.27 33.68,81.33 33.68,80.21 32.15,78.68 29.39,78.68 28.57,77.86 26.74,77.86 U1.8
OI2  (via drill 0.35)
  Top 0.203: v45.11,79.5 47.45,77.15 48.07,77.15 OR2.2 | v43.78,80.82 43.27,80.82 42.76,81.33 OK3.13 42.66,81.33 39.49,78.17 29.49,78.17 27.96,76.64 26.74,76.64 U1.7
  Bottom 0.203: v43.78,80.82 v45.11,79.5
OI3
  Top 0.203: 41.89,77.2 41.84,77.25 41.84,77.97 42.66,78.78 OK3.11 | 41.89,77.2 42.15,76.95 43.37,76.95 43.98,76.33 48.07,76.33 OR2.3 | 41.89,77.2 40,75.31 26.74,75.31 U1.6
OI4
  Top 0.203: OR2.4 48.07,75.62 43.37,75.62 42.76,76.23 OK3.9 42.66,76.23 41.33,74.91 30.11,74.91 29.29,74.09 26.74,74.09 U1.5
RAW_IV
  Top 0.254: 40.51,25.92 40.51,34.8 GPIO.1 | 40.51,25.92 36.64,22.04 PC1.+ | 53.37,14.08 63.58,14.08 64.6,13.06 64.6,12.14 66.23,10.51 68.78,10.51 70.72,8.57 PF1.2 | 53.37,14.08 52.96,14.08 50.62,11.74 50.01,11.74 PIC33.1 | 40.51,25.92 52.66,25.92 53.37,25.21 53.37,14.08
RD+  (via drill 0.35)
  Top 0.203: ERN1.6 61.13,32.45 64.29,32.45 66.23,34.39 68.88,34.39 U$2.RD+ | v52.25,32.04 49.39,34.9 47.96,34.9 ENC.13
  Bottom 0.203: v52.25,32.04 57.05,32.04 58.78,30.31 68.78,30.31 70.01,31.53 70.01,33.37 68.99,34.39 U$2.RD+
RD-  (via drill 0.35)
  Top 0.203: v62.05,31.02 61.54,31.53 61.13,31.53 ERN1.5 | v46.53,35.51 47.86,35.51 ENC.12
  Bottom 0.203: v62.05,31.02 58.68,31.02 57.76,31.94 57.76,33.78 57.81,33.83 | 57.81,33.83 62.15,38.17 66.33,38.17 U$2.RD- | v46.53,35.51 56.13,35.51 57.81,33.83
RESET  (via drill 0.35)
  Top 0.203: R2.1 55.92,82.05 58.07,82.05 C2.1 58.17,82.05 58.48,82.05 64.09,87.66 66.64,87.66 67.66,88.68 68.48,88.68 BL.5 | v64.7,72.15 62.56,70.01 MC.29 62.45,69.9 59.39,66.84 59.39,57.96 71.03,46.33 78.89,46.33 82.66,42.55 82.66,25.1 81.54,23.98 81.54,21.02 SR.1
  Bottom 0.203: v64.7,72.15 64.7,72.86 68.07,76.23 68.07,80.31 69.9,82.15 69.9,87.36 68.58,88.68 BL.5
RXI
  Top 0.203: MC.30 62.97,69.29 62.97,68.99 59.8,65.82 59.8,59.8 72.15,47.45 PP.4
TD+  (via drill 0.35)
  Top 0.203: v58.88,33.88 59.8,33.88 ERN1.1 | v60.31,35.31 60.11,35.51 55.21,35.51 ENC.17
  Bottom 0.203: U$2.TD+ 68.88,31.84 68.78,31.74 58.58,31.74 58.17,32.15 58.17,32.76 58.88,33.47 v58.88,33.88 v60.31,35.31
TD-
  Top 0.203: 57.81,32.4 57.15,31.74 57.15,31.53 56.94,31.33 55.82,31.33 55.62,31.53 55.62,33.37 56.23,33.98 56.23,34.59 55.92,34.9 55.21,34.9 ENC.16 | 57.81,32.4 58.58,33.17 59.8,33.17 ERN1.2 | 57.81,32.4 59.9,30.31 62.76,30.31 65.52,33.06 66.33,33.06 U$2.TD-
TXO
  Top 0.203: MC.31 63.58,68.78 63.58,68.48 60.21,65.11 60.21,61.74 71.94,50.01 72.15,50.01 PP.3
VDDO  (via drill 0.35)
  Top 0.254: D2.3 21.74,56.74 D1.3 21.84,56.84 22.25,56.84 23.47,58.07 23.47,61.13 22.14,62.45 D3.3 | v18.78,61.84 18.16,62.45 17.76,62.45 D4.3 | v20.72,62.35 21.64,62.35 21.74,62.45 D3.3 | 21.18,75.77 23.47,73.48 23.47,63.88 22.14,62.56 21.84,62.56 D3.3 | 21.18,75.77 17.96,78.99 17.35,78.99 U1.10 | OR5.5 49.39,69.6 49.39,70.31 OR5.6 49.39,70.42 49.39,71.03 OR5.7 49.39,71.23 49.39,71.84 OR5.8 49.49,71.84 v50.31,71.84 | OR3.8 49.39,83.89 49.39,83.17 OR3.7 49.39,83.07 49.39,82.35 OR3.6 49.39,82.25 49.39,81.54 OR3.5 49.29,81.44 v50.31,80.42 | OMF.1 23.47,87.36 OD2.C 23.57,91.64 25.21,93.27 29.19,93.27 32.15,90.31 32.15,87.46 EC6.+ 32.35,87.46 v33.98,85.82 | v24.19,78.78 21.18,75.77
  Bottom 0.254: v18.78,61.84 20.21,61.84 v20.72,62.35 | v50.31,71.84 v50.31,80.42 45.21,80.42 39.8,85.82 v33.98,85.82 31.23,85.82 v24.19,78.78
VIN
  Top 0.203: 74.24,5.77 74.29,5.82 80.52,5.82 81.95,4.39 PJ1.VIN0 | 74.24,5.77 72.76,4.29 70.21,4.29 PD1.A | XV.2 5,47.25 9.18,47.25 16.53,39.9 33.98,39.9 37.86,36.02 40.92,36.02 45,31.94 48.37,31.94 48.88,31.43 48.88,30.31 52.25,26.94 62.86,26.94 68.58,21.23 68.58,17.96 74.19,12.35 74.19,5.82 74.24,5.77
WFGPIO0  (via drill 0.35)
  Top 0.203: v64.8,63.07 66.03,64.29 67.25,64.29 WIFI.GPIO0
  Bottom 0.203: v64.8,63.07 53.47,63.07 40.62,50.21 GPIO.13
WFGPIO2
  Bottom 0.203: WIFI.GPIO2 64.7,64.39 63.98,64.39 62.97,65.41 54.7,65.41 40.51,51.23 39.09,51.23 38.06,50.21 GPIO.14

## Text on the board
tPlace: ON | Edge | IOTECH © 2019 | IOTB v2.8 TOP | S/N: | www.iotech.com.tr
bPlace: IOTB BOT | IOTECH
bNames: C:/Users/celikada/Downloads/5.bmp